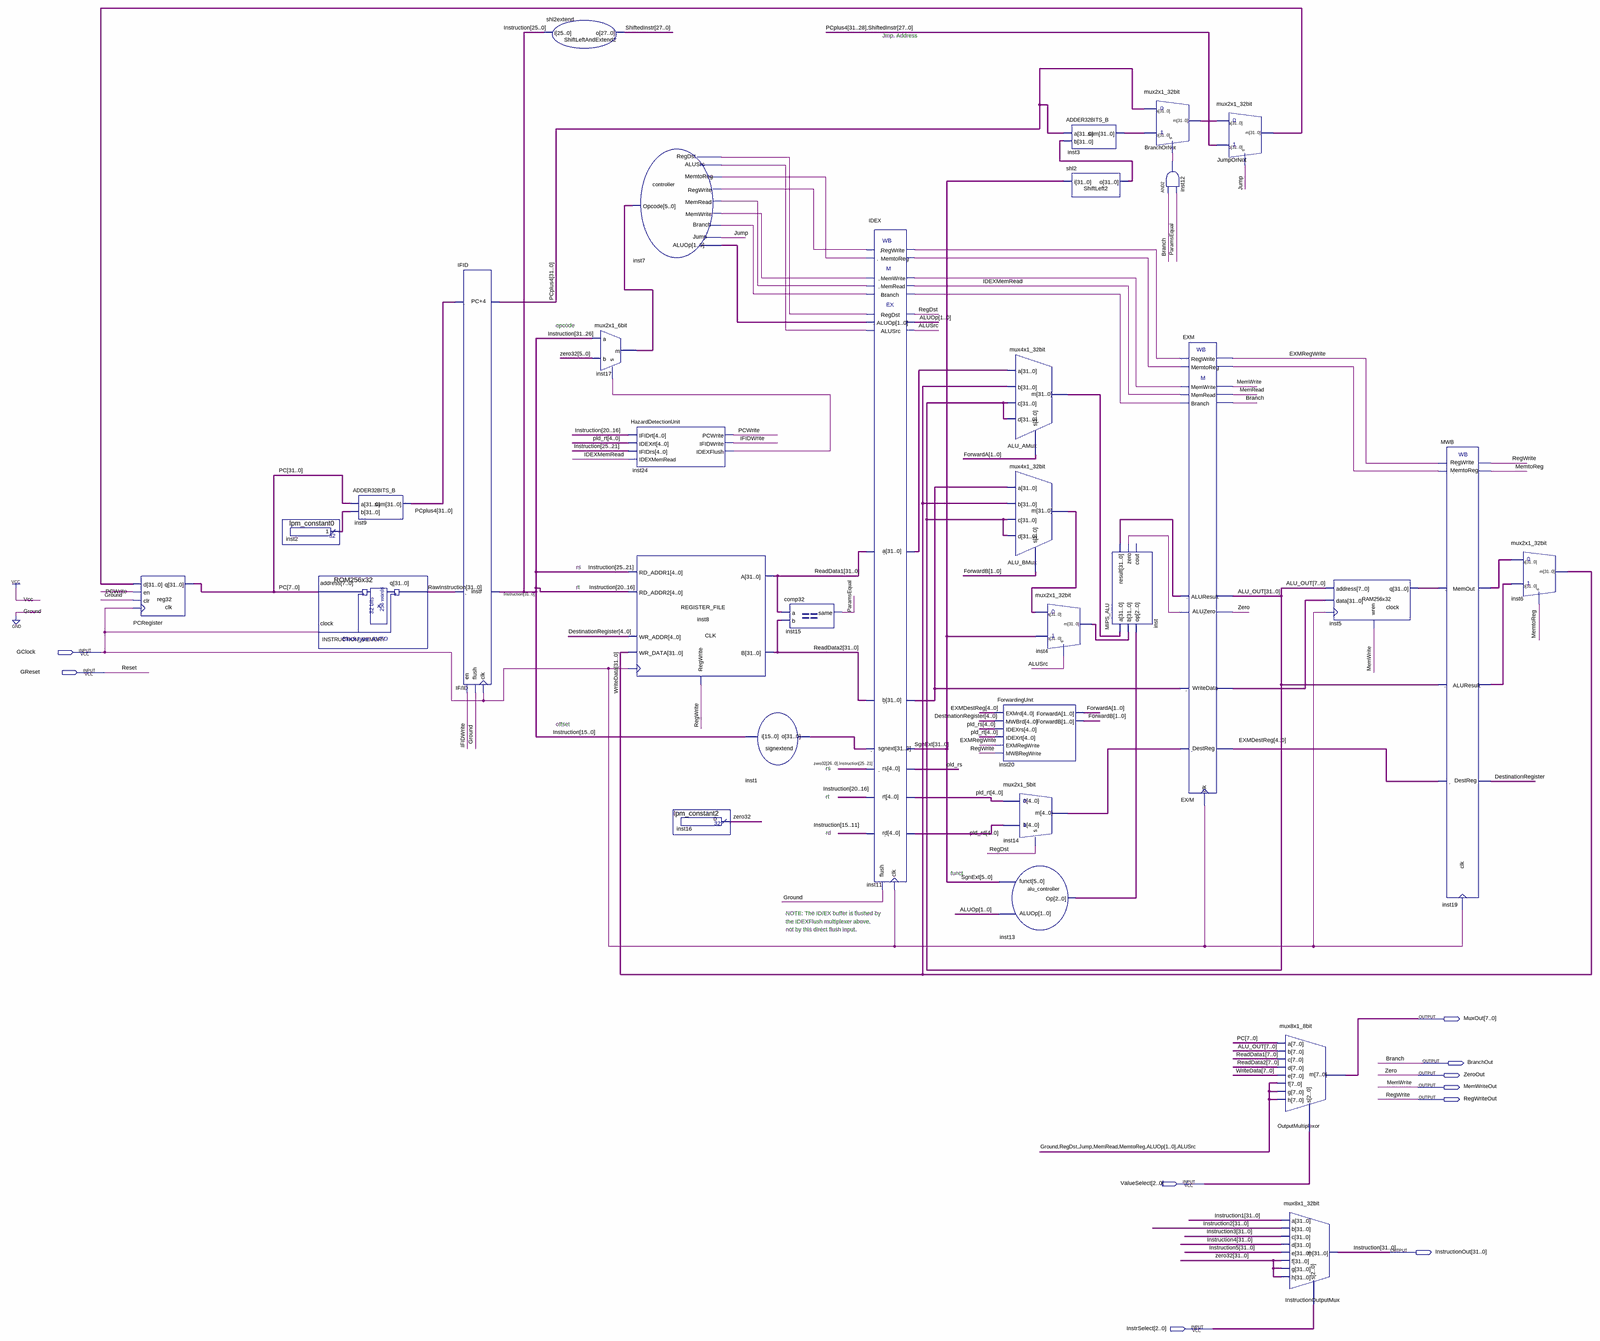
[diagram p0: schematic sheet, whole]
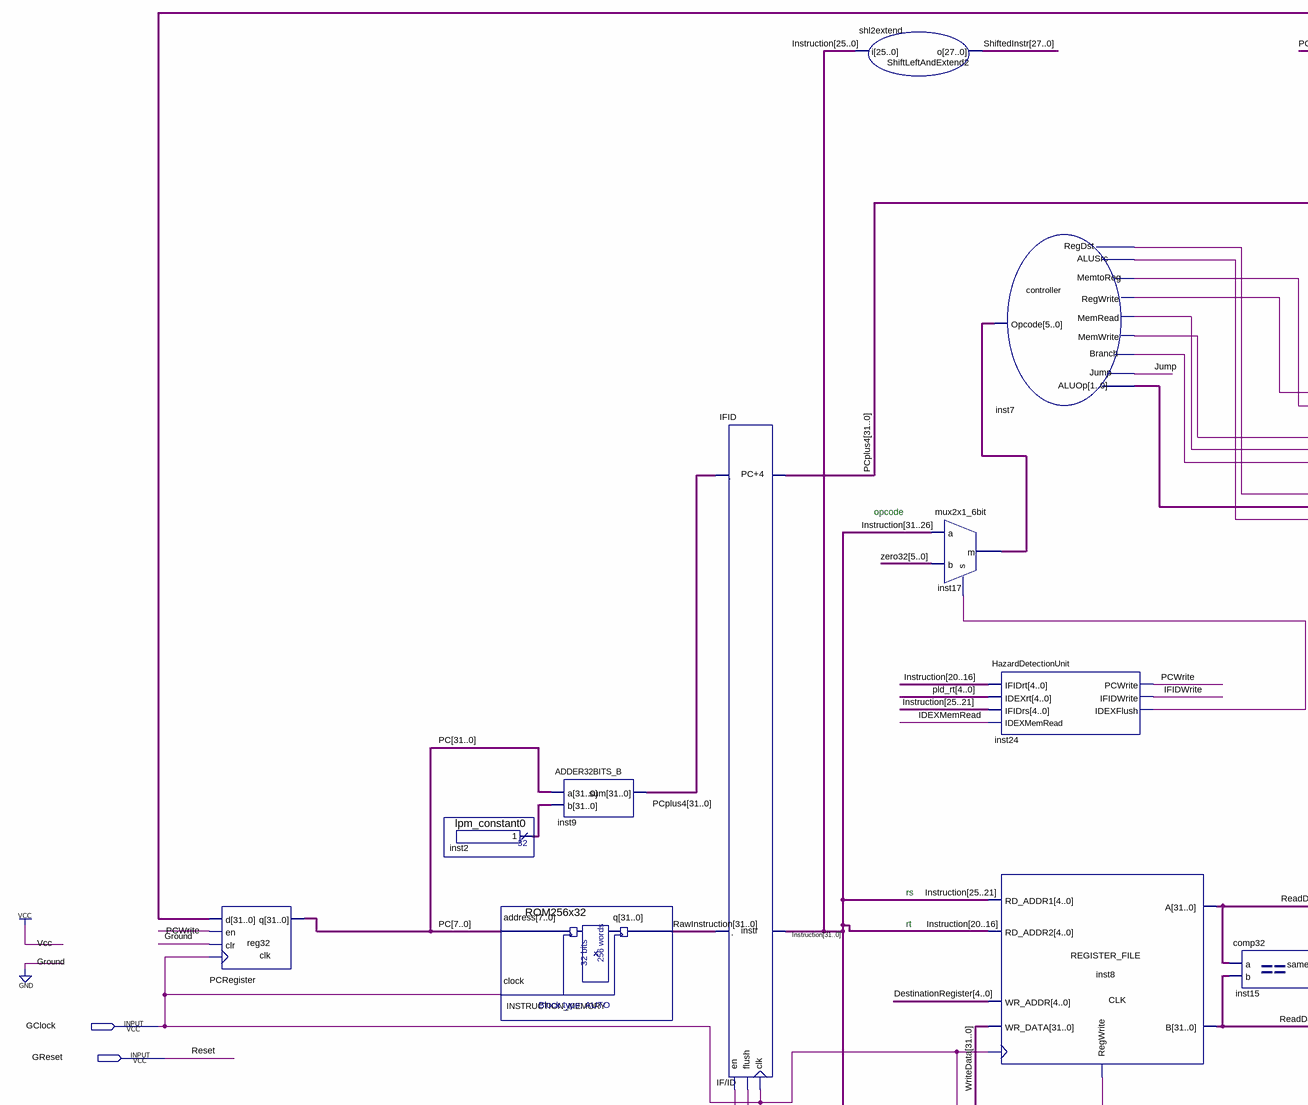
[diagram p1: schematic sheet, upper left part]
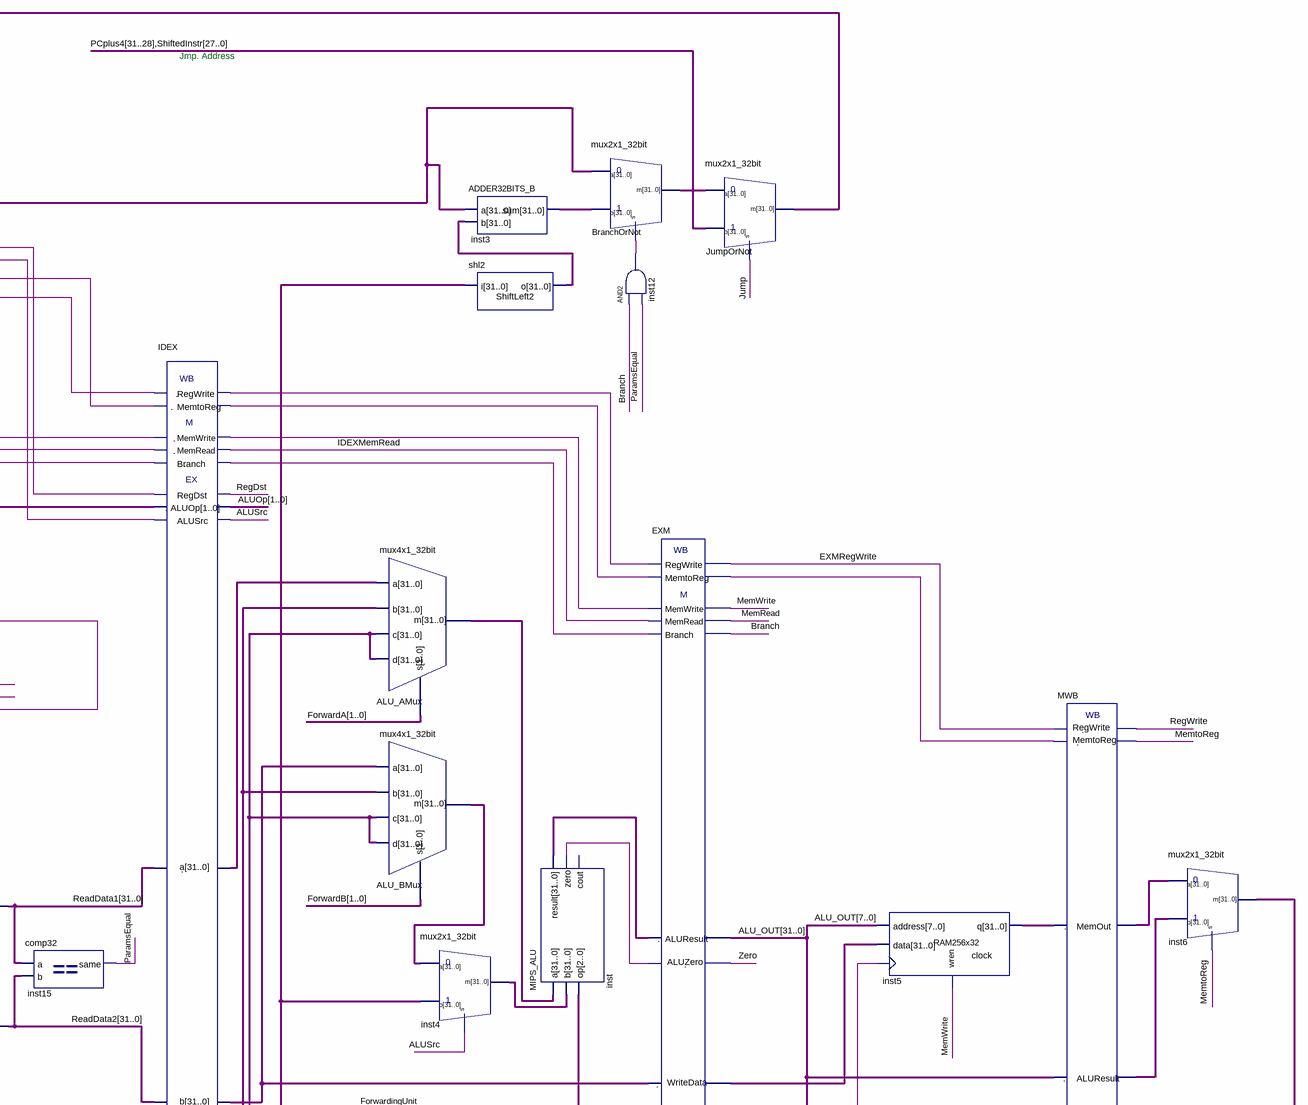
[diagram p2: schematic sheet, upper right part]
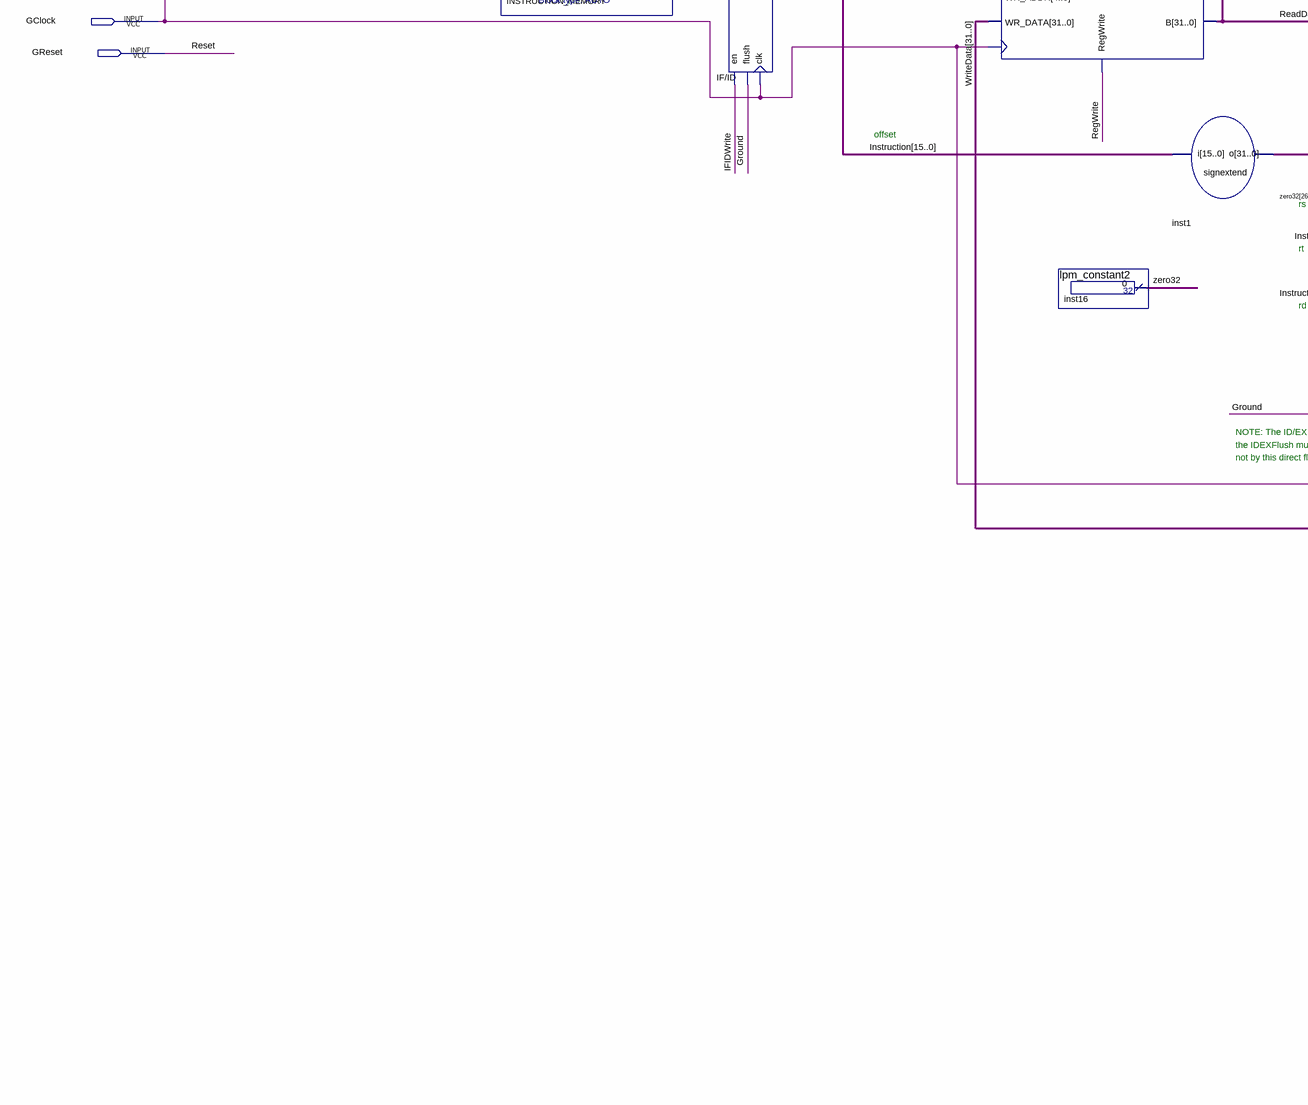
[diagram p3: schematic sheet, lower left part]
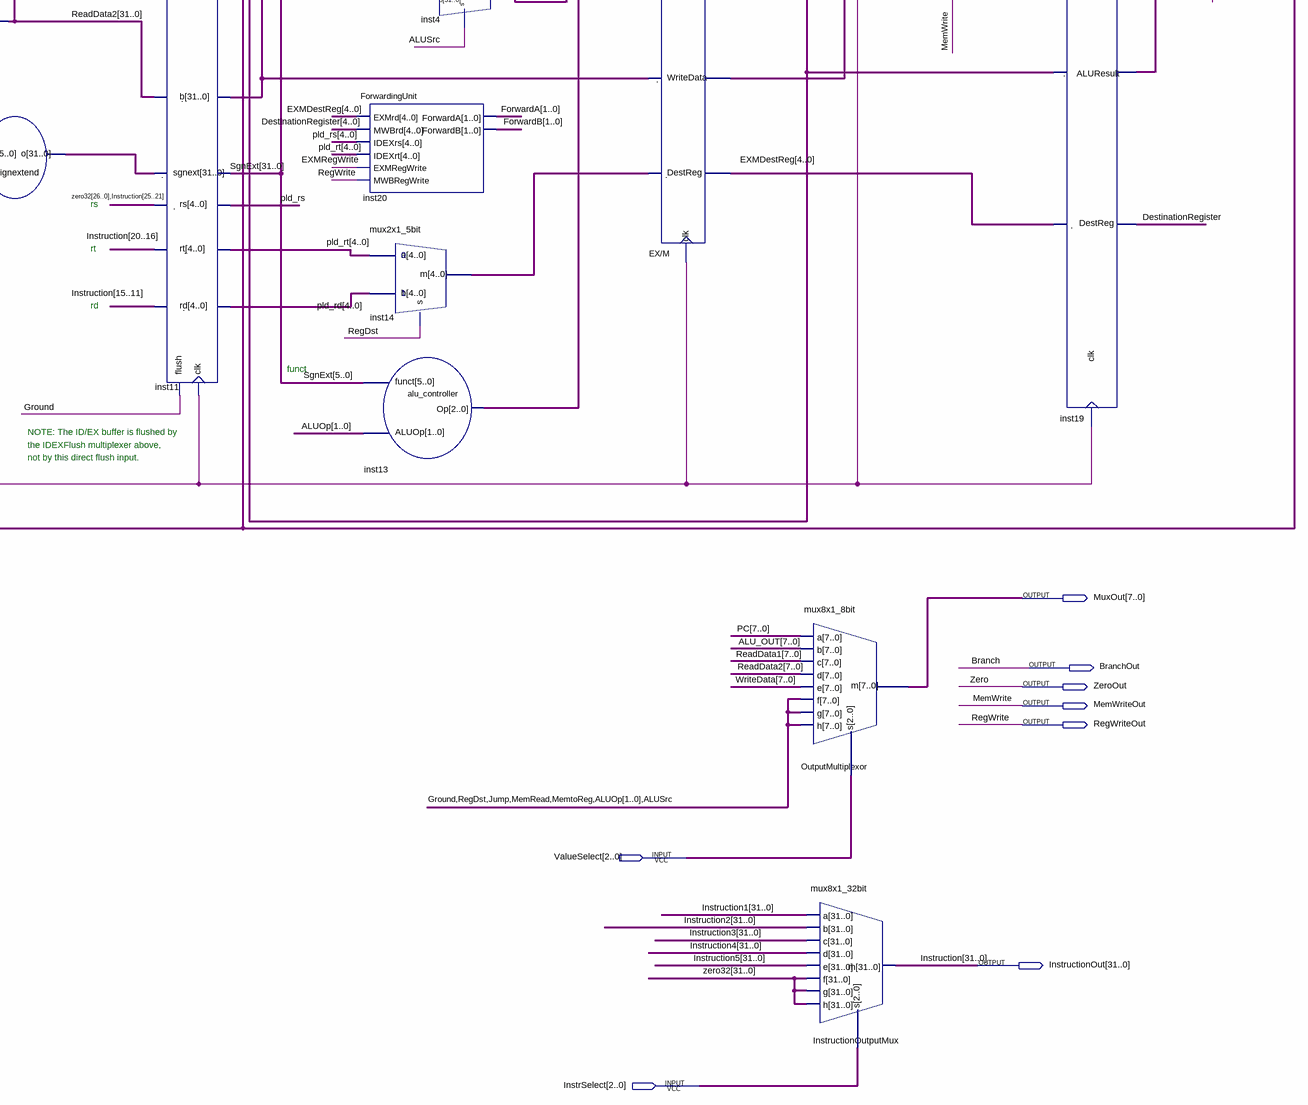
[diagram p4: schematic sheet, lower right part]
// Quartus schematic MIPS_PROCESSOR.bdf as structural Verilog: 32 symbols, 10 pins
module MIPS_PROCESSOR (
  input  GClock,
  input  GReset,
  input  [2:0] ValueSelect,
  input  [2:0] InstrSelect,
  output [7:0] MuxOut,
  output BranchOut,
  output ZeroOut,
  output MemWriteOut,
  output RegWriteOut,
  output [31:0] InstructionOut
);

  wire ALUSrc, DestinationRegister_1bit, EX_M_o_memtoreg, EXMRegWrite, IDEXMemRead, IFIDWrite, inst7_alusrc,
       inst7_branch, inst7_memread, inst7_memtoreg, inst7_memwrite, inst7_regdst, inst7_regwrite,
       inst11_o_branch, inst11_o_memtoreg, inst11_o_memwrite, inst11_o_regwrite, inst12_out,
       inst24_idexflush, inst_zero, Jump, MemRead, MemtoReg, ParamsEqual, PCWrite, pld_rs_1bit, RegDst,
       zero32_1bit;
  wire [1:0] ALUOp, ForwardA, ForwardB, inst7_aluop;
  wire [2:0] inst13_op;
  wire [4:0] DestinationRegister, EXMDestReg, inst14_m, pld_rd, pld_rs, pld_rt;
  wire [5:0] inst17_m;
  wire [27:0] ShiftedInstr;
  wire [31:0] ALU_AMux_m, ALU_BMux_m, ALU_OUT, BranchOrNot_m, EX_M_o_writedata, inst1_o, inst2_result,
       inst3_sum, inst4_m, inst5_q, inst11_o_a, inst11_o_b, inst19_o_aluresult, inst19_o_memout, inst_result,
       Instruction1, Instruction2, Instruction3, Instruction4, Instruction5, JumpOrNot_m, PC, PCplus4,
       RawInstruction, ReadData1, ReadData2, SgnExt, ShiftLeft2_o, WriteData, zero32;

  reg32 PCRegister (.d(JumpOrNot_m), .en(PCWrite), .clr(1'b0), .clk(GClock), .q(PC));
  lpm_constant0 inst2 (.result(inst2_result));
  ROM256x32 INSTRUCTION_MEMORY (.address(PC[7:0]), .clock(GClock), .q(RawInstruction));
  ADDER32BITS_B inst9 (.a(PC), .b(inst2_result), .sum(PCplus4));
  IFID \IF/ID  (
    .en(IFIDWrite), .flush(1'b0), .clk(GClock), .i_pc4(PCplus4), .i_ins(RawInstruction), .o_pc4(PCplus4),
    .o_ins(InstructionOut));
  shl2extend ShiftLeftAndExtend2 (.i(InstructionOut[25:0]), .o(ShiftedInstr));
  mux2x1_6bit inst17 (.s(inst24_idexflush), .a(InstructionOut[31:26]), .b(zero32[5:0]), .m(inst17_m));
  controller inst7 (
    .Opcode(inst17_m), .RegDst(inst7_regdst), .ALUSrc(inst7_alusrc), .MemtoReg(inst7_memtoreg),
    .RegWrite(inst7_regwrite), .MemRead(inst7_memread), .MemWrite(inst7_memwrite), .Branch(inst7_branch),
    .Jump(Jump), .ALUOp(inst7_aluop));
  HazardDetectionUnit inst24 (
    .IFIDrt(InstructionOut[20:16]), .IDEXrt(pld_rt), .IFIDrs(InstructionOut[25:21]),
    .IDEXMemRead(IDEXMemRead), .PCWrite(PCWrite), .IFIDWrite(IFIDWrite), .IDEXFlush(inst24_idexflush));
  REGISTER_FILE inst8 (
    .WR_DATA(WriteData), .RD_ADDR1(InstructionOut[25:21]), .RD_ADDR2(InstructionOut[20:16]),
    .WR_ADDR(DestinationRegister), .RegWrite(RegWriteOut), .CLK(GClock), .A(ReadData1), .B(ReadData2));
  lpm_constant2 inst16 (.result(zero32_1bit));
  signextend inst1 (.i(InstructionOut[15:0]), .o(inst1_o));
  comp32 inst15 (.b(ReadData2), .a(ReadData1), .same(ParamsEqual));
  IDEX inst11 (
    .flush(1'b0), .clk(GClock), .i_MemtoReg(inst7_memtoreg), .i_RegWrite(inst7_regwrite),
    .i_MemWrite(inst7_memwrite), .i_MemRead(inst7_memread), .i_Branch(inst7_branch), .i_RegDst(inst7_regdst),
    .i_ALUOp(inst7_aluop), .i_ALUSrc(inst7_alusrc), .i_a(ReadData1), .i_b(ReadData2), .i_signext(inst1_o),
    .i_rt(InstructionOut[20:16]), .i_rd(InstructionOut[15:11]),
    .i_pc4({zero32[26:0], InstructionOut[25:21]}), .o_RegWrite(inst11_o_regwrite),
    .o_MemtoReg(inst11_o_memtoreg), .o_MemWrite(inst11_o_memwrite), .o_MemRead(IDEXMemRead),
    .o_Branch(inst11_o_branch), .o_RegDst(RegDst), .o_ALUOp(ALUOp), .o_ALUSrc(ALUSrc), .o_b(inst11_o_b),
    .o_signext(SgnExt), .o_rt(pld_rt), .o_rd(pld_rd), .o_a(inst11_o_a), .o_pc4(pld_rs_1bit));
  mux4x1_32bit ALU_AMux (.a(inst11_o_a), .b(WriteData), .c(ALU_OUT), .d(ALU_OUT), .s(ForwardA), .m(ALU_AMux_m));
  mux4x1_32bit ALU_BMux (.a(inst11_o_b), .b(WriteData), .c(ALU_OUT), .d(ALU_OUT), .s(ForwardB), .m(ALU_BMux_m));
  ForwardingUnit inst20 (
    .EXMrd(EXMDestReg), .MWBrd(DestinationRegister), .IDEXrs(pld_rs), .IDEXrt(pld_rt),
    .EXMRegWrite(EXMRegWrite), .MWBRegWrite(RegWriteOut), .ForwardA(ForwardA), .ForwardB(ForwardB));
  mux2x1_5bit inst14 (.a(pld_rt), .b(pld_rd), .s(RegDst), .m(inst14_m));
  alu_controller inst13 (.ALUOp(ALUOp), .funct(SgnExt[5:0]), .Op(inst13_op));
  mux2x1_32bit inst4 (.s(ALUSrc), .a(ALU_BMux_m), .b(SgnExt), .m(inst4_m));
  ADDER32BITS_B inst3 (.a(PCplus4), .b(ShiftLeft2_o), .sum(inst3_sum));
  shl2 ShiftLeft2 (.i(SgnExt), .o(ShiftLeft2_o));
  MIPS_ALU inst (.a(ALU_AMux_m), .b(inst4_m), .op(inst13_op), .result(inst_result), .zero(inst_zero));  // open: cout
  mux2x1_32bit BranchOrNot (.s(inst12_out), .a(PCplus4), .b(inst3_sum), .m(BranchOrNot_m));
  and inst12 (inst12_out, BranchOut, ParamsEqual);
  EXM \EX/M  (
    .i_RegWrite(inst11_o_regwrite), .i_MemtoReg(inst11_o_memtoreg), .i_MemWrite(inst11_o_memwrite),
    .i_MemRead(IDEXMemRead), .i_Branch(inst11_o_branch), .i_aluresult(inst_result), .i_aluzero(inst_zero),
    .i_writedata(inst11_o_b), .i_destreg(inst14_m), .clk(GClock), .o_RegWrite(EXMRegWrite),
    .o_MemtoReg(EX_M_o_memtoreg), .o_MemWrite(MemWriteOut), .o_MemRead(MemRead), .o_Branch(BranchOut),
    .o_aluresult(ALU_OUT), .o_aluzero(ZeroOut), .o_writedata(EX_M_o_writedata), .o_destreg(EXMDestReg));
  mux2x1_32bit JumpOrNot (.s(Jump), .a(BranchOrNot_m), .b({PCplus4[31:28], ShiftedInstr}), .m(JumpOrNot_m));
  mux8x1_8bit OutputMultiplexor (
    .a(PC[7:0]), .b(ALU_OUT[7:0]), .c(ReadData1[7:0]), .d(ReadData2[7:0]), .e(WriteData[7:0]),
    .f({1'b0, RegDst, Jump, MemRead, MemtoReg, ALUOp, ALUSrc}),
    .g({1'b0, RegDst, Jump, MemRead, MemtoReg, ALUOp, ALUSrc}),
    .h({1'b0, RegDst, Jump, MemRead, MemtoReg, ALUOp, ALUSrc}), .s(ValueSelect), .m(MuxOut));
  mux8x1_32bit InstructionOutputMux (
    .a(Instruction1), .b(Instruction2), .c(Instruction3), .d(Instruction4), .e(Instruction5), .f(zero32),
    .g(zero32), .h(zero32), .s(InstrSelect), .m(InstructionOut));
  RAM256x32 inst5 (.address(ALU_OUT[7:0]), .data(EX_M_o_writedata), .wren(MemWriteOut), .clock(GClock), .q(inst5_q));
  MWB inst19 (
    .i_RegWrite(EXMRegWrite), .i_MemtoReg(EX_M_o_memtoreg), .i_memout(inst5_q), .i_aluresult(ALU_OUT),
    .i_destreg(EXMDestReg), .clk(GClock), .o_RegWrite(RegWriteOut), .o_MemtoReg(MemtoReg),
    .o_memout(inst19_o_memout), .o_aluresult(inst19_o_aluresult), .o_destreg(DestinationRegister_1bit));
  mux2x1_32bit inst6 (.s(MemtoReg), .a(inst19_o_memout), .b(inst19_o_aluresult), .m(WriteData));

  // Other names for the same wires on the sheet: Branch = BranchOut; Instruction[31:0] = InstructionOut;
  //   MemWrite = MemWriteOut; RegWrite = RegWriteOut; Reset = GReset; Zero = ZeroOut

  // Notes on the sheet:
  //   Jmp. Address
  //   opcode
  //   rs
  //   rt
  //   offset
  //   rs
  //   rt
  //   rd
  //   funct
  //   NOTE: The ID/EX buffer is flushed by
  //   the IDEXFlush multiplexer above,
  //   not by this direct flush input.
endmodule
